# EAGLE design MPPT-LTC4162-F (EAGLE 9.6.2)
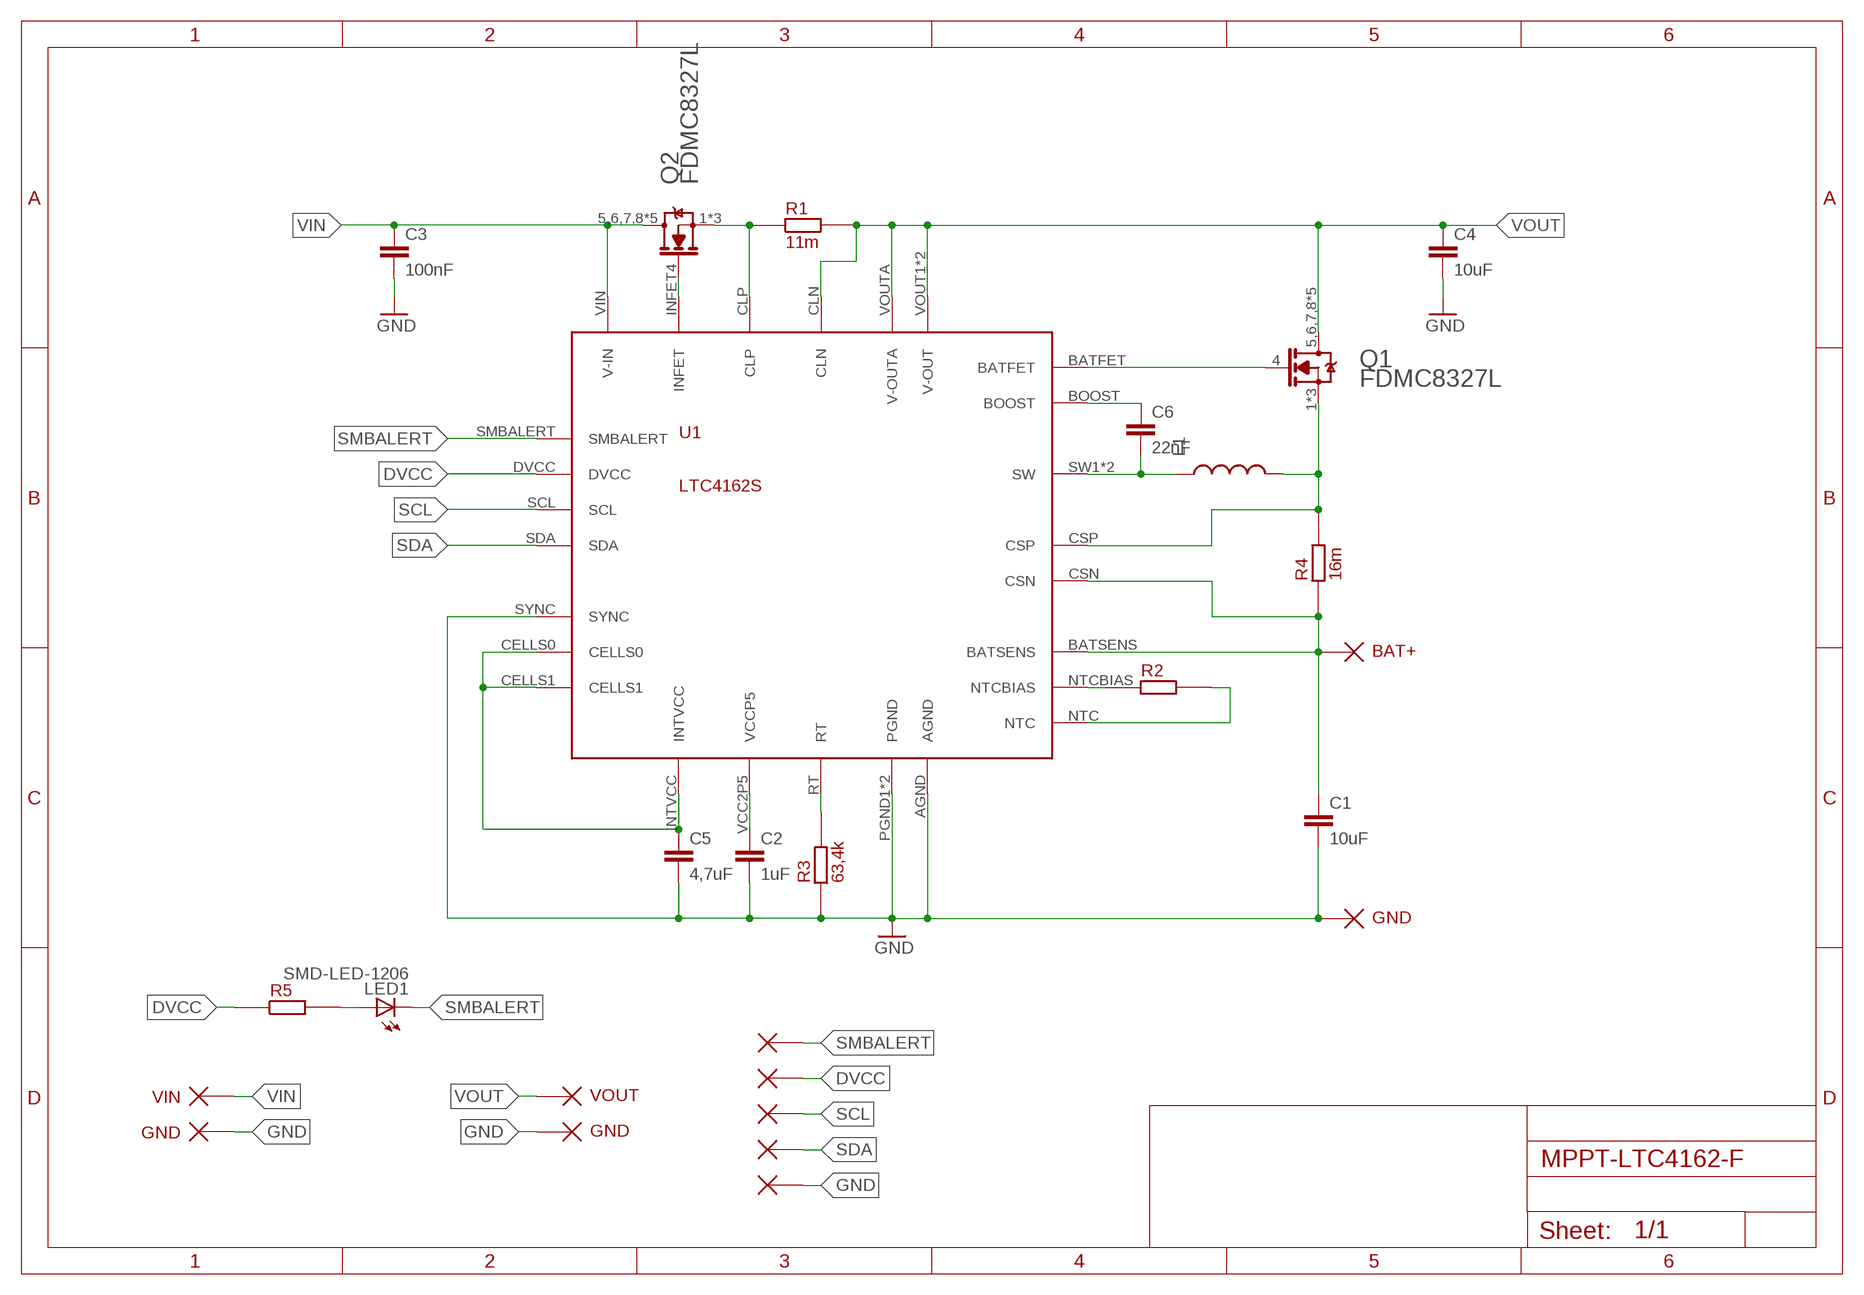
[diagram p0: schematic, sheet 1]

## Parts
C1  10uF  SMD-C-1206  [C1206]
C2  1uF  SMD-C-1206  [C1206]
C3  100nF  SMD-C-1206  [C1206]
C4  10uF  SMD-C-1206  [C1206]
C5  4,7uF  SMD-C-1206  [C1206]
C6  22nF  SMD-C-1206  [C1206]
L1  L-242408FPS  [L-SMD-FPD]
LED1  SMD-LED-1206  [LED_1206]
P1  VIN  PIN  [PIN]
P2  GND  PIN  [PIN]
P3  PIN  [PIN]
P4  PIN  [PIN]
P5  PIN  [PIN]
P6  PIN  [PIN]
P7  GND  PIN  [PIN]
P8  BAT+  PIN  [PIN]
P9  VOUT  PIN  [PIN]
P10  GND  PIN  [PIN]
P11  PIN  [PIN]
Q1  N-MOSFET_FDMC8327LFDMC8327L  [ON_SEMI_FDMC8327L_0]
Q2  N-MOSFET_FDMC8327LFDMC8327L  [ON_SEMI_FDMC8327L_0]
R1  11m  SMD-RR1206  [C1206]
R2  SMD-RR1206  [C1206]
R3  63,4k  SMD-RR1206  [C1206]
R4  16m  SMD-RR1206  [C1206]
R5  SMD-RR0603  [R0603]
U1  LTC4162S  LTC4162-F  [QFN28-4X5MM]

## Nets
DVCC: P4.P$1 R5.1 U1.DVCC
GND: C1.2 C2.2 C3.2 C4.2 C5.2 P2.P$1 P7.P$1 P10.P$1 P11.P$1 R3.1 U1.AGND U1.PGND1(PGND) U1.PGND2(PGND) U1.SYNC
INFET: Q2.4(G) U1.INFET
N$1: C5.1 U1.CELLS0 U1.CELLS1 U1.INTVCC
N$2: R3.2 U1.RT
N$3: C2.1 U1.VCC2P5(VCCP5)
N$4: R2.1 U1.NTCBIAS
N$5: R2.2 U1.NTC
N$6: Q1.4(G) U1.BATFET
N$7: C1.1 P8.P$1 R4.1 U1.BATSENS U1.CSN
N$8: L1.2 Q1.1(1_S) Q1.2(1_S) Q1.3(1_S) R4.2 U1.CSP
N$9: C6.2 L1.1 U1.SW1(SW) U1.SW2(SW)
N$10: C6.1 U1.BOOST
N$12: Q2.1(1_S) Q2.2(1_S) Q2.3(1_S) R1.1 U1.CLP
N$13: LED1.A R5.2
SCL: P5.P$1 U1.SCL
SDA: P6.P$1 U1.SDA
SMBALERT: LED1.C P3.P$1 U1.SMBALERT
VIN: C3.1 P1.P$1 Q2.5,6,7,8(D) Q2.5,6,7,8-2(D) Q2.5,6,7,8-3(D) Q2.5,6,7,8-4(D) Q2.5,6,7,8-5(D) U1.VIN(V-IN)
VOUT: C4.1 P9.P$1 Q1.5,6,7,8(D) Q1.5,6,7,8-2(D) Q1.5,6,7,8-3(D) Q1.5,6,7,8-4(D) Q1.5,6,7,8-5(D) R1.2 U1.CLN U1.VOUT1(V-OUT) U1.VOUT2(V-OUT) U1.VOUTA(V-OUTA)

## Library data of the parts
C1-C6 = Standardbauteile:SMD-C-1206
L1 = Standardbauteile:L-242408FPS
LED1 = Standardbauteile:SMD-LED-1206
P1-P11 = Mechanik:PIN
Q1 Q2 = MOSFET:N-MOSFET_FDMC8327L: Trans MOSFET N-CH 40V 12A 8-Pin Power 33 T/R; CENTROID_NOT_SPECIFIED: No; CONTINUOUS_DRAIN_CURRENT: 12A; DATASHEET: http://www.onsemi.com/pub/Collateral/FDMC8327L-D.pdf; DEVICE_CLASS_L1: Discrete Semiconductors; DEVICE_CLASS_L2: Transistors; DEVICE_CLASS_L3: MOSFETs; DIGIKEY_DESCRIPTION: TRANS MOSFET N-CH 40V 12A 8MLP; DIGIKEY_PART_NUMBER: FDMC8327LCT-ND; DRAIN_TO_SOURCE_BREAKDOWN_VOLTAGE: 40V; DRAIN_TO_SOURCE_RESISTANCE: 7.4mΩ; DRAIN_TO_SOURCE_VOLTAGE: 40V; FOOTPRINT_URL: http://www.onsemi.com/pub/Collateral/511DR.PDF; FOOTPRINT_VARIANT_NAME_0: Recommended_Land_Pattern; GATE_TO_SOURCE_VOLTAGE: 20V; HEIGHT: 0.8mm; INPUT_CAPACITACE_AT_VDS: 1235pF @ 20V; LEAD_FREE: yes; MAX_JUNCTION_TEMP: +150°C; MF: ON Semi; MFG_PACKAGE_IDENT: 511DR; MFG_PACKAGE_IDENT_DATE: 09/2018; MFG_PACKAGE_IDENT_REV: A; MOUSER_PART_NUMBER: 512-FDMC8327L; MPN: FDMC8327L; NUMBER_OF_CHANNELS: 1; NUMBER_OF_N_CHANNELS: 1; PACKAGE: WDFN8; POWER_DISSIPATION: 2.3W; PREFIX: Q; ROHS: yes; STANDOFF_HEIGHT: 0mm; TECHNOLOGY: MOSFET; TEMPERATURE_RANGE_HIGH: +150°C; TEMPERATURE_RANGE_LOW: -55°C; THRESHOLD_VGS: 1.7V; TURN_OFF_DELAY_TIME: 20ns; TURN_ON_DELAY_TIME: 8.4ns; VERIFICATION_VERSION: 0.0.0.1
R1-R5 = Standardbauteile:SMD-R
U1 = Spannungsregler:LTC4162-F

## Board
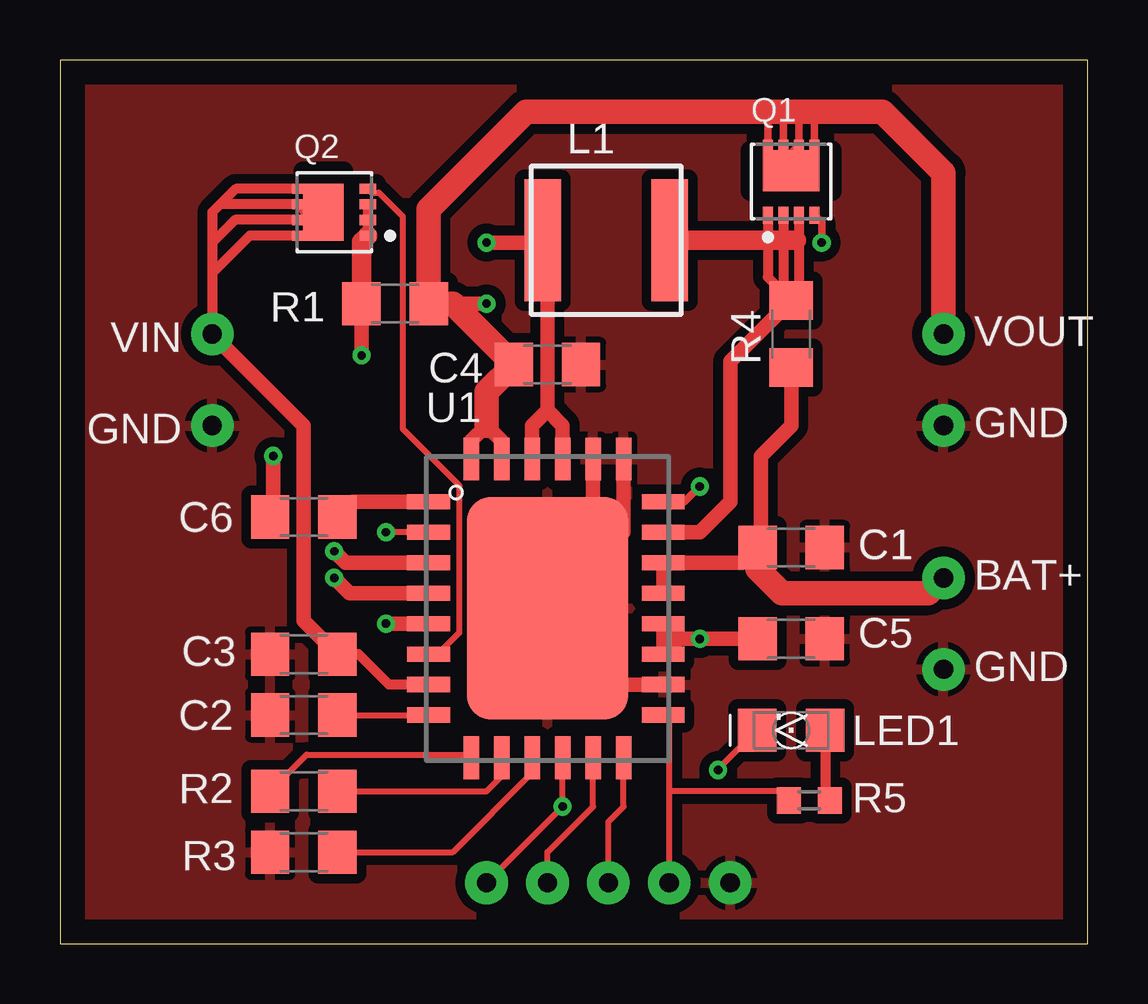
[diagram p1: board, top side]
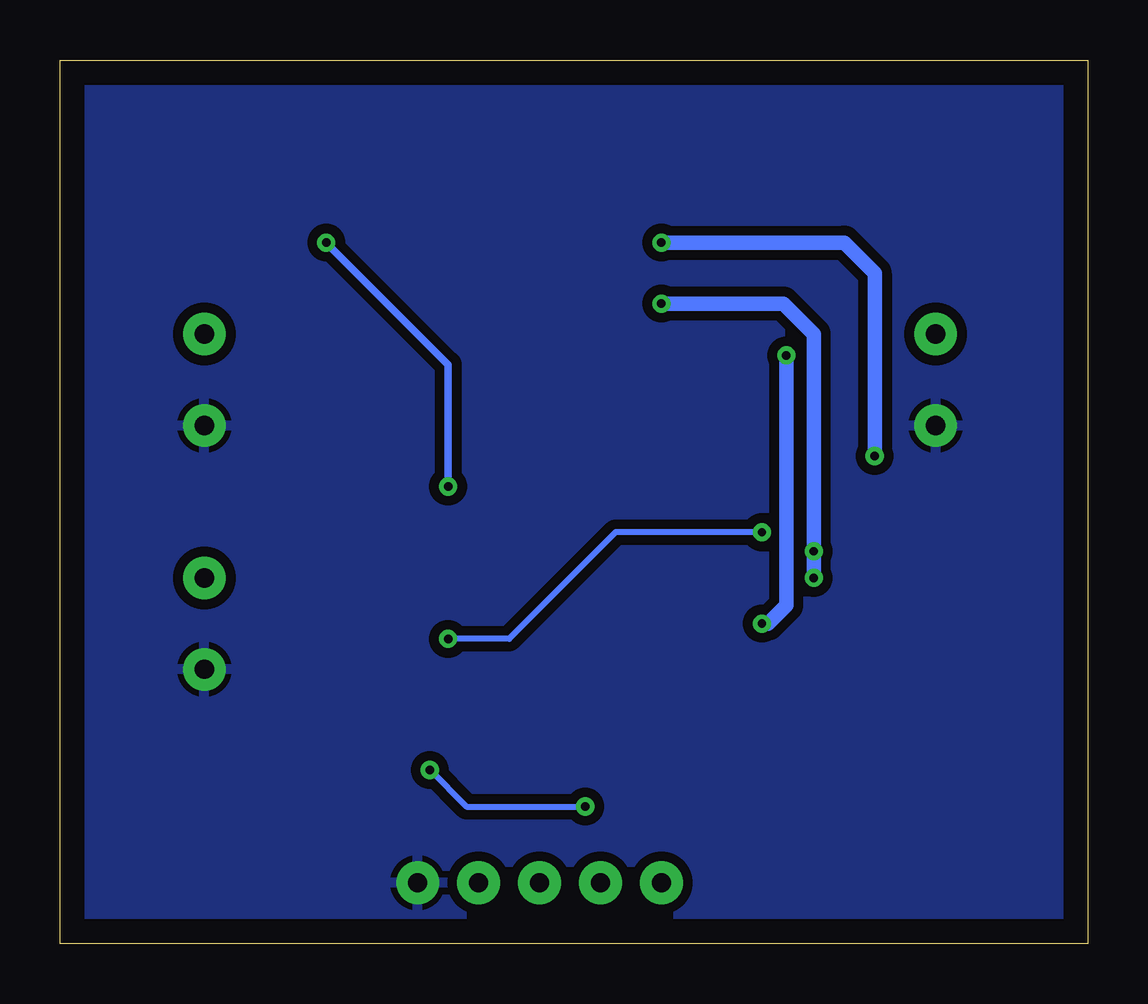
[diagram p2: board, bottom side, seen from below]

Size 42.85 x 36.82 mm. Coordinates in mm from the lower left corner, seen from the top.
Outline: 0,0 42.85,0 42.85,36.82 0,36.82 0,0
Copper layers (1*16): Top 0.035mm / dielectric 1.5mm / Bottom 0.035mm
Design rules "default": minimum track width 6mil, minimum drill 0.35mm, track to track 6mil, track to pad 6mil, pad to pad 6mil, via to via 6mil, smd to smd 6mil, copper to edge 40mil, drill to drill 6mil, minimum pad ring 10mil, minimum via ring 8mil, stop-mask expansion 4mil, vias tented up to drill 0mil, thermal gap 10mil

### Footprints (pad centres in the part's own frame; a part is rotated, then mirrored left to right if it is on the bottom)
C1206 = smd 1.6 x 1.8: 1 -1.4,0; 2 1.4,0
L-SMD-FPD = smd 1.524 x 5.08: 1 -2.735,0.1; 2 2.565,0.1
LED_1206 = smd 1.6 x 1.803: A -1.422,0; C 1.422,0
PIN = drill 0.8 pad 1.778: P$1 0,0
ON_SEMI_FDMC8327L_0 = smd 0.42 x 0.7: 1 -0.975,-1.4; 2 -0.325,-1.4; 3 0.325,-1.4; 4 0.975,-1.4 | smd 2.37 x 1.7: 5,6,7,8 0,0.45 | smd 0.42 x 0.45: 5,6,7,8-2 -0.975,1.525; 5,6,7,8-3 -0.325,1.525; 5,6,7,8-4 0.325,1.525; 5,6,7,8-5 0.975,1.525
R0603 = smd 1 x 1.1: 1 -0.85,0; 2 0.85,0
QFN28-4X5MM = smd 6.731 x 9.271: AGND 0,0 | smd 1.778 x 0.635: BATFET 4.826,4.445; BATSENS 4.826,0.635; BOOST -4.953,4.445; CELLS0 4.826,-1.905; CELLS1 4.826,-0.635; CLN -4.953,0.635; CLP -4.953,-0.635; CSN 4.826,1.905; CSP 4.826,3.175; DVCC 4.826,-4.445; INFET -4.953,-1.905; INTVCC -4.953,3.175; SYNC 4.826,-3.175; VCC2P5 -4.953,-4.445; VIN -4.953,-3.175; VOUTA -4.953,1.905 | smd 0.635 x 1.778: NTC -1.905,-6.223; NTCBIAS -3.175,-6.223; PGND1 3.175,6.223; PGND2 1.905,6.223; RT -0.635,-6.223; SCL 1.905,-6.223; SDA 3.175,-6.223; SMBALERT 0.635,-6.223; SW1 0.635,6.223; SW2 -0.635,6.223; VOUT1 -1.905,6.223; VOUT2 -3.175,6.223

### Placement (x,y rotation side)
C1  30.48,16.51 0 top
C2  10.16,9.53 180 top
C3  10.16,12.06 180 top
C4  20.32,24.13 0 top
C5  30.48,12.7 0 top
C6  10.16,17.78 180 top
L1  22.86,29.21 0 top
LED1  30.48,8.89 180 top
P1  6.35,25.4 0 top
P2  6.35,21.59 0 top
P3  17.78,2.54 0 top
P4  25.4,2.54 0 top
P5  20.32,2.54 0 top
P6  22.86,2.54 0 top
P7  36.83,21.59 0 top
P8  36.83,15.24 0 top
P9  36.83,25.4 0 top
P10  36.83,11.43 0 top
P11  27.94,2.54 0 top
Q1  30.48,31.75 0 top
Q2  11.43,30.48 90 top
R1  13.97,26.67 0 top
R2  10.16,6.35 0 top
R3  10.16,3.81 0 top
R4  30.48,25.4 90 top
R5  31.24,5.97 0 top
U1  20.32,13.97 0 top

### Tracks (layer width: path | path; a pad name or v marks a point on that pad's centre or on a via)
DVCC
  Top 0.254: P4.P$1 25.4,6.35 | 25.4,6.35 25.4,9.27 U1.DVCC | R5.1 30.01,6.35 25.4,6.35
GND
  Top 0.61: U1.PGND2 22.23,15.88 U1.AGND | U1.PGND1 23.5,17.14 U1.AGND | U1.SYNC 23.5,10.79 U1.AGND
  pour Top (isolate 0.406): 0,0 0,36.83 44.45,36.83 44.45,0
  pour Bottom (isolate 0.406): 0,36.83 0,0 44.45,0 44.45,36.83
INFET
  Top 0.254: 15.7,12.06 U1.INFET 15.75,12.06 16.64,12.95 16.64,19.1 14.29,21.45 14.29,30.3 13.3,31.29 12.99,31.29 Q2.4
N$1  (via drill 0.35)
  Top 0.254: U1.INTVCC v13.59,17.14
  Top 0.61: C5.1 v26.67,12.7 25.78,12.7 | 25.78,12.7 U1.CELLS1 U1.CELLS0 25.78,12.7
  Bottom 0.254: v13.59,17.14 19.68,17.14 24.13,12.7 v26.67,12.7
N$2
  Top 0.254: U1.RT 19.68,7.11 16.38,3.81 R3.2
N$3
  Top 0.254: C2.1 U1.VCC2P5
N$4
  Top 0.254: R2.1 10.28,7.87 17.02,7.87 U1.NTCBIAS
N$5
  Top 0.254: R2.2 17.78,6.35 18.41,6.99 U1.NTC
N$6  (via drill 0.35)
  Top 0.305: Q1.4 31.75,30.05 v31.75,29.21 | v26.67,19.05 26.04,18.41 U1.BATFET
  Bottom 0.305: v31.75,29.21 26.67,24.13 v26.67,19.05
N$7
  Top 0.61: U1.BATSENS U1.CSN 28.45,15.88 C1.1 29.21,16.64 29.21,20.32 30.48,21.59 R4.1
  Top 1.016: C1.1 29.08,15.62 30.1,14.61 36.2,14.61 P8.P$1
N$8
  Top 0.406: Q1.3 30.8,29.21 | 30.8,29.21 30.8,27.12 R4.2 | Q1.2 30.16,27.12 R4.2 | Q1.1 29.5,27.77 R4.2 | 30.7,29.31 30.8,29.21
  Top 0.61: U1.CSP 26.67,17.14 27.94,18.41 27.94,24.26 R4.2
  Top 0.813: L1.2 30.7,29.31
N$9  (via drill 0.35)
  Top 0.61: U1.SW2 19.68,21.59 20.32,22.23 | 20.32,22.23 20.32,29.11 L1.1 20.02,29.21 v17.78,29.21 | U1.SW1 20.95,21.59 20.32,22.23 | v8.89,20.32 8.89,17.91 C6.2
  Bottom 0.61: v17.78,29.21 10.16,29.21 8.89,27.94 v8.89,20.32
N$10
  Top 0.61: U1.BOOST 12.2,18.41 C6.1
N$12  (via drill 0.35)
  Top 0.406: Q2.3 Q2.2 Q2.1
  Top 0.61: U1.CLP v13.59,13.34 | v12.57,24.51 R1.1
  Top 0.813: Q2.1 12.57,29.25 R1.1
  Bottom 0.61: v13.59,13.34 13.34,13.34 12.57,14.1 v12.57,24.51
N$13
  Top 0.406: LED1.A 31.9,6.16 R5.2
SCL
  Top 0.254: P5.P$1 20.32,3.81 22.23,5.71 U1.SCL
SDA
  Top 0.254: P6.P$1 22.86,5.08 23.5,5.71 U1.SDA
SMBALERT  (via drill 0.35)
  Top 0.254: P3.P$1 v20.95,5.71 U1.SMBALERT | LED1.C 27.43,7.26 v27.43,7.24
  Bottom 0.254: v27.43,7.24 25.91,5.71 v20.95,5.71
VIN
  Top 0.406: 6.64,25.11 P1.P$1 6.35,27.94 | Q2.5,6,7,8 10.23,30.48 Q2.5,6,7,8-4 6.67,30.8 | Q2.5,6,7,8-5 7.33,31.45 6.67,30.8 | 6.35,29.21 6.35,30.48 6.67,30.8 | 6.35,29.21 6.35,27.94 | Q2.5,6,7,8-3 7.29,30.16 6.35,29.21 | Q2.5,6,7,8-2 7.92,29.5 6.35,27.94 | U1.VIN 13.72,10.79 12.45,12.06 C3.1
  Top 0.61: P1.P$1 10.16,21.59 10.16,13.46 C3.1
VOUT  (via drill 0.35)
  Top 0.305: Q1.5,6,7,8-5 31.45,34.38 31.75,34.67 | Q1.5,6,7,8-3 30.16,34.35 30.48,34.67 30.8,34.35 Q1.5,6,7,8-4 30.48,32.95 Q1.5,6,7,8 | Q1.5,6,7,8-2 29.5,34.38 29.21,34.67
  Top 0.61: U1.VOUT1 18.41,20.95 17.78,21.59 17.14,20.95 U1.VOUT2 | U1.CLN 12.06,14.61 v11.43,15.24 | v17.78,26.67 R1.2 | U1.VOUTA 11.9,15.88 v11.43,16.35
  Top 1.016: P9.P$1 36.83,32.13 34.29,34.67 31.75,34.67 30.48,34.67 29.21,34.67 19.43,34.67 15.37,30.61 R1.2 16.38,26.67 C4.1 17.78,22.99 17.78,21.59
  Bottom 0.61: v11.43,15.24 v11.43,16.35 11.43,25.4 12.7,26.67 v17.78,26.67